# Altium schematic sheet pblaze_ext.schdoc
size A2; Symbol: Sheet-Symbol_A4; Device: Sheet-Symbol_A4; Company: 嘉立创EDA; Version: V1.0; Page Size: A4; @Project Name: pblaze_ext; @Page Count: 1; @Update Date: 2025-08-26; @Create Date: 2025-08-26; @Schematic Name: Schematic1; @Page No: 1; @Page Name: P1; @Board Name: pblaze_ext; @Create Time: 11:14:01; @Update Time: 11:14:05
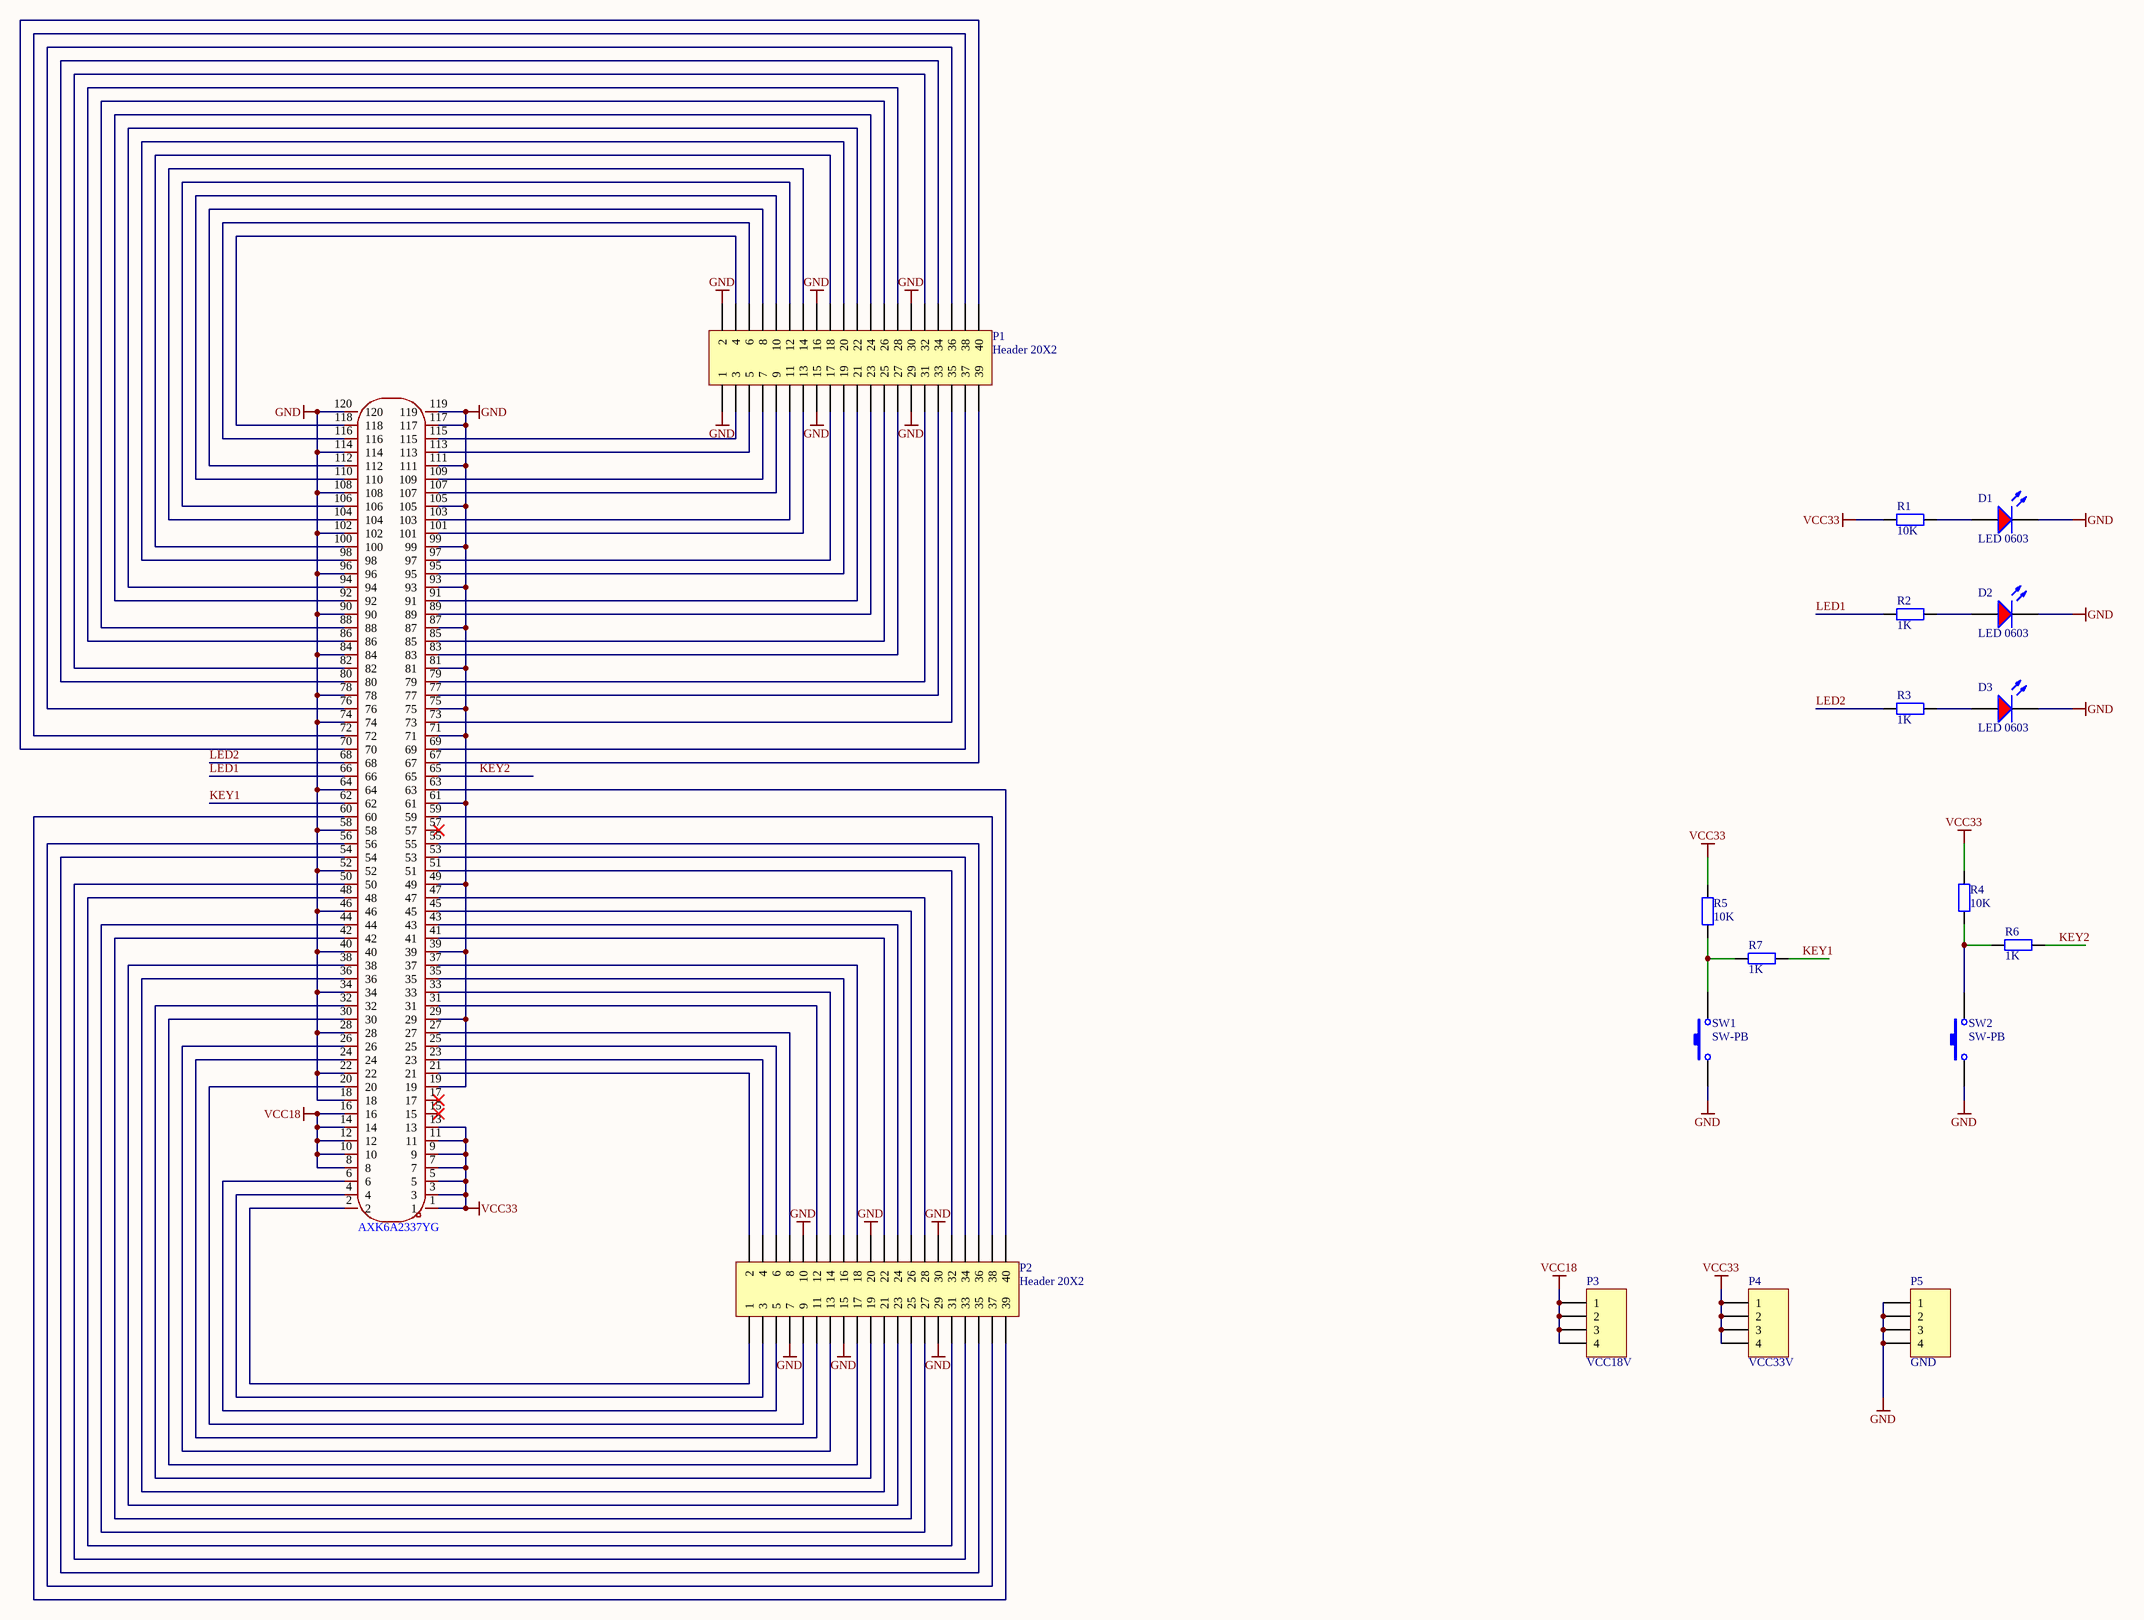
[diagram p0: pblaze_ext.schdoc]

## Parts
D1  LED 0603  [0603_LED_S1]
D2  LED 0603  [0603_LED_S1]
D3  LED 0603  [0603_LED_S1]
P1  Header 20X2  [HDR2X20]
P2  Header 20X2  [HDR2X20]
P3  VCC18V  [HDR1X4]
P4  VCC33V  [HDR1X4]
P5  GND  [HDR1X4]
R1  10K  [0603_R]
R2  1K  [0603_R]
R3  1K  [0603_R]
R4  10K  [0603_R]
R5  10K  [0603_R]
R6  1K  [0603_R]
R7  1K  [0603_R]
SW1  SW-PB  [SW-2- 3.8X7.6-S]
SW2  SW-PB  [SW-2- 3.8X7.6-S]
U1  AXK6A2337YG  [CONN-SMD_120P-P0.50_AXK6A2337YG]

## Nets
GND: D1.K D2.K D3.K P1.1 P1.2 P1.15 P1.16 P1.29 P1.30 P2.7 P2.10 P2.15 P2.20 P2.29 P2.30 P5.1 P5.2 P5.3 P5.4 SW1.1 SW2.1 U1.18 U1.19 U1.22 U1.28 U1.29 U1.34 U1.39 U1.40 U1.46 U1.49 U1.52 U1.58 U1.61 U1.64 U1.71 U1.74 U1.75 U1.78 U1.81 U1.84 U1.87 U1.90 U1.93 U1.96 U1.99 U1.102 U1.105 U1.108 U1.111 U1.114 U1.117 U1.119 U1.120
VCC18: P3.1 P3.2 P3.3 P3.4 U1.8 U1.10 U1.12 U1.14 U1.16
VCC33: P4.1 P4.2 P4.3 P4.4 R1.1 R4.2 R5.2 U1.1 U1.3 U1.5 U1.7 U1.9 U1.11 U1.13
KEY1: R7.1 U1.62
KEY2: R6.1 U1.65
LED1: R2.1 U1.66
LED2: R3.1 U1.68
NetD1_A: D1.A R1.2
NetD2_A: D2.A R2.2
NetD3_A: D3.A R3.2
NetP1_3: P1.3 U1.115
NetP1_4: P1.4 U1.118
NetP1_5: P1.5 U1.113
NetP1_6: P1.6 U1.116
NetP1_7: P1.7 U1.109
NetP1_8: P1.8 U1.112
NetP1_9: P1.9 U1.107
NetP1_10: P1.10 U1.110
NetP1_11: P1.11 U1.103
NetP1_12: P1.12 U1.106
NetP1_13: P1.13 U1.101
NetP1_14: P1.14 U1.104
NetP1_17: P1.17 U1.97
NetP1_18: P1.18 U1.100
NetP1_19: P1.19 U1.95
NetP1_20: P1.20 U1.98
NetP1_21: P1.21 U1.91
NetP1_22: P1.22 U1.94
NetP1_23: P1.23 U1.89
NetP1_24: P1.24 U1.92
NetP1_25: P1.25 U1.85
NetP1_26: P1.26 U1.88
NetP1_27: P1.27 U1.83
NetP1_28: P1.28 U1.86
NetP1_31: P1.31 U1.79
NetP1_32: P1.32 U1.82
NetP1_33: P1.33 U1.77
NetP1_34: P1.34 U1.80
NetP1_35: P1.35 U1.73
NetP1_36: P1.36 U1.76
NetP1_37: P1.37 U1.69
NetP1_38: P1.38 U1.72
NetP1_39: P1.39 U1.67
NetP1_40: P1.40 U1.70
NetP2_1: P2.1 U1.2
NetP2_2: P2.2 U1.21
NetP2_3: P2.3 U1.4
NetP2_4: P2.4 U1.23
NetP2_5: P2.5 U1.6
NetP2_6: P2.6 U1.25
NetP2_8: P2.8 U1.27
NetP2_9: P2.9 U1.20
NetP2_11: P2.11 U1.24
NetP2_12: P2.12 U1.31
NetP2_13: P2.13 U1.26
NetP2_14: P2.14 U1.33
NetP2_16: P2.16 U1.35
NetP2_17: P2.17 U1.30
NetP2_18: P2.18 U1.37
NetP2_19: P2.19 U1.32
NetP2_21: P2.21 U1.36
NetP2_22: P2.22 U1.41
NetP2_23: P2.23 U1.38
NetP2_24: P2.24 U1.43
NetP2_25: P2.25 U1.42
NetP2_26: P2.26 U1.45
NetP2_27: P2.27 U1.44
NetP2_28: P2.28 U1.47
NetP2_31: P2.31 U1.48
NetP2_32: P2.32 U1.51
NetP2_33: P2.33 U1.50
NetP2_34: P2.34 U1.53
NetP2_35: P2.35 U1.54
NetP2_36: P2.36 U1.55
NetP2_37: P2.37 U1.56
NetP2_38: P2.38 U1.59
NetP2_39: P2.39 U1.60
NetP2_40: P2.40 U1.63
NetR4_1: R4.1 R6.2 SW2.2
NetR5_1: R5.1 R7.2 SW1.2

Not connected (* = marked no-connect by the designer): U1 15* 17* 57*

## Notes on the sheet
- Title
- Size:
- Date:
- File:
- A2
- Number:
- Time:
- Revision:
- Sheet
- of

## Library data of the parts
D1-D3 = 0603 红灯: 发光二极管; ComponentLink1Description: 供应商链接; ComponentLink1URL: http://www.szlcsc.com/product/details_2659.html; Package: 0603; Supplier: LC; SuppliersPartNumber: C2286
P1 P2 = Header 20X2: Header, 20-Pin, Dual row; LatestRevisionDate: 17-Jul-2002; LatestRevisionNote: Re-released for DXP Platform.; Publisher: Altium Limited
P3-P5 = Header 4: Header, 4-Pin; LatestRevisionDate: 17-Jul-2002; LatestRevisionNote: Re-released for DXP Platform.; Publisher: Altium Limited
R1-R7 = 0603 1KΩ (1001) 1%: 贴片电阻; ComponentLink1Description: 供应商链接; ComponentLink1URL: http://www.szlcsc.com/product/details_21904.html; Package: 0603; Supplier: LC; SuppliersPartNumber: C21190
SW1 SW2 = SW-PB: 按钮开关; 版本: 1.0; 生产厂商1: CTS; 等级: B类; 分类: 开关; 更新者: 安菲; 订货型号1: SW-PB; 更新日期: 2014.8.12
U1 = AXK6A2337YG: Manufacturer: PANASONIC(松下); Add into BOM: yes; Pitch: 0.5mm; Gender: 公; Symbol: AXK6A2337YG; Device: AXK6A2337YG; Supplier: LCSC; Supplier Part: C2843222; Manufacturer Part: AXK6A2337YG; JLCPCB Part Class: ExtendedPart; LCSC Part Name: PIN：120P间距0.5mm公立贴; Supplier Footprint: SMD,P=0.5mm; Datasheet: https://atta.szlcsc.com/upload/public/pdf/source/20210629/C2843222_34423164C22E29E0883A2BD91D744717.pdf; Convert to PCB: yes; Number of Pins: 120P; Number of Rows: 2; Mounting Style: 立贴; Contact Plating: 金